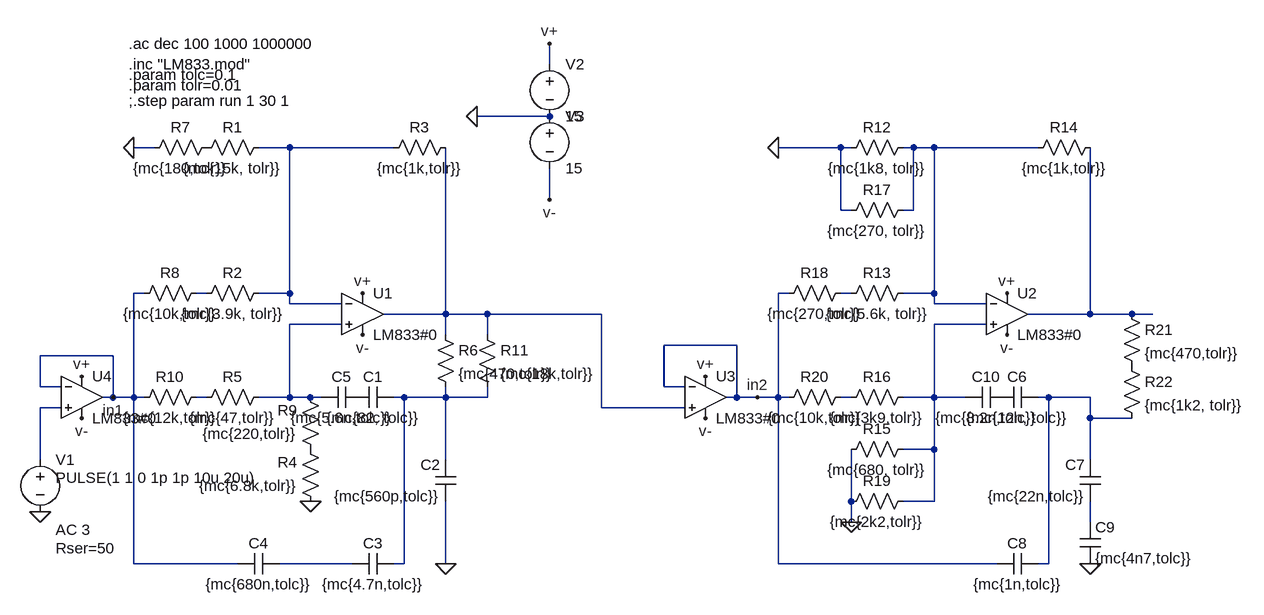
[diagram p0: schematic sedra version 2.asc]
sedra version 2.asc, the LTspice schematic file:
Version 4
SHEET 1 1792 788
WIRE 608 -48 608 -80
WIRE 608 32 496 32
WIRE 0 80 -32 80
WIRE 208 80 160 80
WIRE 368 80 208 80
WIRE 1056 80 960 80
WIRE 1072 80 1056 80
WIRE 1168 80 1152 80
WIRE 1200 80 1168 80
WIRE 1360 80 1200 80
WIRE 608 160 608 112
WIRE 1056 176 1056 80
WIRE 1072 176 1056 176
WIRE 1168 176 1168 80
WIRE 1168 176 1152 176
WIRE -16 304 -32 304
WIRE 80 304 64 304
WIRE 208 304 208 80
WIRE 208 304 160 304
WIRE 976 304 960 304
WIRE 1072 304 1056 304
WIRE 1200 304 1200 80
WIRE 1200 304 1152 304
WIRE 208 320 208 304
WIRE 288 320 208 320
WIRE 1200 320 1200 304
WIRE 1280 320 1200 320
WIRE 448 336 448 80
WIRE 448 336 352 336
WIRE 512 336 448 336
WIRE 688 336 512 336
WIRE 1440 336 1440 80
WIRE 1440 336 1344 336
WIRE 1504 336 1440 336
WIRE 1536 336 1504 336
WIRE 288 352 208 352
WIRE 1280 352 1200 352
WIRE 448 368 448 336
WIRE 512 368 512 336
WIRE 896 384 784 384
WIRE -64 400 -176 400
WIRE -176 448 -176 400
WIRE -144 448 -176 448
WIRE 784 448 784 384
WIRE 816 448 784 448
WIRE -64 464 -64 400
WIRE -64 464 -80 464
WIRE -32 464 -32 304
WIRE -32 464 -64 464
WIRE -16 464 -32 464
WIRE 80 464 64 464
WIRE 208 464 208 352
WIRE 208 464 160 464
WIRE 240 464 208 464
WIRE 256 464 240 464
WIRE 320 464 304 464
WIRE 384 464 368 464
WIRE 448 464 448 448
WIRE 448 464 384 464
WIRE 512 464 512 448
WIRE 512 464 448 464
WIRE 896 464 896 384
WIRE 896 464 880 464
WIRE 928 464 896 464
WIRE 960 464 960 304
WIRE 960 464 928 464
WIRE 976 464 960 464
WIRE 1072 464 1056 464
WIRE 1200 464 1200 352
WIRE 1200 464 1152 464
WIRE 1248 464 1200 464
WIRE 1312 464 1296 464
WIRE 1376 464 1360 464
WIRE 1440 464 1376 464
WIRE -144 480 -176 480
WIRE 688 480 688 336
WIRE 816 480 688 480
WIRE 1440 496 1440 464
WIRE 1504 496 1440 496
WIRE 1200 544 1200 464
WIRE 1200 544 1152 544
WIRE -176 560 -176 480
WIRE 448 560 448 464
WIRE 1440 560 1440 496
WIRE 1072 624 1072 544
WIRE 1200 624 1200 544
WIRE 1200 624 1152 624
WIRE 1072 656 1072 624
WIRE 1440 656 1440 624
WIRE -32 720 -32 464
WIRE 128 720 -32 720
WIRE 304 720 192 720
WIRE 384 720 384 464
WIRE 384 720 368 720
WIRE 448 720 448 624
WIRE 960 720 960 464
WIRE 1296 720 960 720
WIRE 1376 720 1376 464
WIRE 1376 720 1360 720
FLAG -32 80 0
FLAG 240 624 0
FLAG 448 720 0
FLAG -64 464 in1
FLAG 608 -80 v+
FLAG 320 304 v+
FLAG 320 368 v-
FLAG 608 160 v-
FLAG 496 32 0
FLAG 960 80 0
FLAG 1440 720 0
FLAG 1312 304 v+
FLAG 1312 368 v-
FLAG 1072 656 0
FLAG 928 464 in2
FLAG -112 432 v+
FLAG 848 432 v+
FLAG -112 496 v-
FLAG 848 496 v-
FLAG -176 640 0
SYMBOL res 176 64 R90
WINDOW 0 0 56 VBottom 2
WINDOW 3 32 56 VTop 2
SYMATTR InstName R1
SYMATTR Value {mc{15k, tolr}}
SYMBOL res 176 288 R90
WINDOW 0 0 56 VBottom 2
WINDOW 3 32 56 VTop 2
SYMATTR InstName R2
SYMATTR Value {mc{3.9k, tolr}}
SYMBOL res 464 64 R90
WINDOW 0 0 56 VBottom 2
WINDOW 3 32 56 VTop 2
SYMATTR InstName R3
SYMATTR Value {mc{1k,tolr}}
SYMBOL res 256 640 R180
WINDOW 0 36 76 Left 2
WINDOW 3 36 40 Left 2
SYMATTR InstName R4
SYMATTR Value {mc{6.8k,tolr}}
SYMBOL res 64 480 R270
WINDOW 0 32 56 VTop 2
WINDOW 3 0 56 VBottom 2
SYMATTR InstName R5
SYMATTR Value {mc{47,tolr}}
SYMBOL cap 368 448 R90
WINDOW 0 0 32 VBottom 2
WINDOW 3 32 32 VTop 2
SYMATTR InstName C1
SYMATTR Value {mc{82, tolc}}
SYMBOL cap 464 624 R180
WINDOW 0 24 56 Left 2
WINDOW 3 24 8 Left 2
SYMATTR InstName C2
SYMATTR Value {mc{560p,tolc}}
SYMBOL cap 304 736 R270
WINDOW 0 32 32 VTop 2
WINDOW 3 0 32 VBottom 2
SYMATTR InstName C3
SYMATTR Value {mc{4.7n,tolc}}
SYMBOL Opamps\\opamp2 320 272 R0
SYMATTR InstName U1
SYMATTR Value LM833#0
SYMBOL res 96 64 R90
WINDOW 0 0 56 VBottom 2
WINDOW 3 32 56 VTop 2
SYMATTR InstName R7
SYMATTR Value {mc{180,tolr}}
SYMBOL res 80 288 R90
WINDOW 0 0 56 VBottom 2
WINDOW 3 32 56 VTop 2
SYMATTR InstName R8
SYMATTR Value {mc{10k,tolr}}
SYMBOL res 256 560 R180
WINDOW 0 36 76 Left 2
WINDOW 3 36 40 Left 2
SYMATTR InstName R9
SYMATTR Value {mc{220,tolr}}
SYMBOL res -32 480 R270
WINDOW 0 32 56 VTop 2
WINDOW 3 0 56 VBottom 2
SYMATTR InstName R10
SYMATTR Value {mc{12k,tolr}}
SYMBOL res 496 352 R0
SYMATTR InstName R11
SYMATTR Value {mc{18k,tolr}}
SYMBOL res 432 352 R0
SYMATTR InstName R6
SYMATTR Value {mc{470,tolr}}
SYMBOL cap 192 704 R90
WINDOW 0 0 32 VBottom 2
WINDOW 3 32 32 VTop 2
SYMATTR InstName C4
SYMATTR Value {mc{680n,tolc}}
SYMBOL cap 320 448 R90
WINDOW 0 0 32 VBottom 2
WINDOW 3 32 32 VTop 2
SYMATTR InstName C5
SYMATTR Value {mc{5.6n,tolc}}
SYMBOL voltage 608 -64 R0
WINDOW 123 0 0 Left 2
WINDOW 39 0 0 Left 2
SYMATTR InstName V2
SYMATTR Value 15
SYMBOL voltage 608 16 R0
SYMATTR InstName V3
SYMATTR Value 15
SYMBOL res 1168 64 R90
WINDOW 0 0 56 VBottom 2
WINDOW 3 32 56 VTop 2
SYMATTR InstName R12
SYMATTR Value {mc{1k8, tolr}}
SYMBOL res 1168 288 R90
WINDOW 0 0 56 VBottom 2
WINDOW 3 32 56 VTop 2
SYMATTR InstName R13
SYMATTR Value {mc{5.6k, tolr}}
SYMBOL res 1456 64 R90
WINDOW 0 0 56 VBottom 2
WINDOW 3 32 56 VTop 2
SYMATTR InstName R14
SYMATTR Value {mc{1k,tolr}}
SYMBOL res 1056 480 R270
WINDOW 0 32 56 VTop 2
WINDOW 3 0 56 VBottom 2
SYMATTR InstName R16
SYMATTR Value {mc{3k9,tolr}}
SYMBOL cap 1360 448 R90
WINDOW 0 0 32 VBottom 2
WINDOW 3 32 32 VTop 2
SYMATTR InstName C6
SYMATTR Value {mc{12n, tolc}}
SYMBOL cap 1456 624 R180
WINDOW 0 24 56 Left 2
WINDOW 3 24 8 Left 2
SYMATTR InstName C7
SYMATTR Value {mc{22n,tolc}}
SYMBOL cap 1296 736 R270
WINDOW 0 32 32 VTop 2
WINDOW 3 0 32 VBottom 2
SYMATTR InstName C8
SYMATTR Value {mc{1n,tolc}}
SYMBOL Opamps\\opamp2 1312 272 R0
SYMATTR InstName U2
SYMATTR Value LM833#0
SYMBOL res 1072 288 R90
WINDOW 0 0 56 VBottom 2
WINDOW 3 32 56 VTop 2
SYMATTR InstName R18
SYMATTR Value {mc{270,tolr}}
SYMBOL res 960 480 R270
WINDOW 0 32 56 VTop 2
WINDOW 3 0 56 VBottom 2
SYMATTR InstName R20
SYMATTR Value {mc{10k,tolr}}
SYMBOL cap 1312 448 R90
WINDOW 0 0 32 VBottom 2
WINDOW 3 32 32 VTop 2
SYMATTR InstName C10
SYMATTR Value {mc{8.2n,tolc}}
SYMBOL res 1168 160 R90
WINDOW 0 0 56 VBottom 2
WINDOW 3 32 56 VTop 2
SYMATTR InstName R17
SYMATTR Value {mc{270, tolr}}
SYMBOL res 1168 528 R90
WINDOW 0 0 56 VBottom 2
WINDOW 3 32 56 VTop 2
SYMATTR InstName R15
SYMATTR Value {mc{680, tolr}}
SYMBOL res 1168 608 R90
WINDOW 0 0 56 VBottom 2
WINDOW 3 32 56 VTop 2
SYMATTR InstName R19
SYMATTR Value {mc{2k2,tolr}}
SYMBOL res 1488 320 R0
SYMATTR InstName R21
SYMATTR Value {mc{470,tolr}}
SYMBOL res 1488 400 R0
SYMATTR InstName R22
SYMATTR Value {mc{1k2, tolr}}
SYMBOL cap 1424 656 R0
SYMATTR InstName C9
SYMATTR Value {mc{4n7,tolc}}
SYMBOL Opamps\\opamp2 -112 400 R0
SYMATTR InstName U4
SYMATTR Value LM833#0
SYMBOL voltage -176 544 R0
WINDOW 123 24 124 Left 2
WINDOW 39 24 152 Left 2
WINDOW 3 24 44 Left 2
SYMATTR Value2 AC 3
SYMATTR SpiceLine Rser=50
SYMATTR InstName V1
SYMATTR Value PULSE(1 1 0 1p 1p 10u 20u)
SYMBOL Opamps\\opamp2 848 400 R0
SYMATTR InstName U3
SYMATTR Value LM833#0
TEXT -40 -48 Left 2 !.inc "LM833.mod"
TEXT -40 -32 Left 2 !.param tolc=0.1
TEXT -40 -16 Left 2 !.param tolr=0.01
TEXT -40 -80 Left 2 !.ac dec 100 1000 1000000
TEXT -40 8 Left 2 !;.step param run 1 30 1

The netlist it stands for:
* sedra version 2.asc
R1 N001 P001 {mc{15k, tolr}}
R2 N001 N003 {mc{3.9k, tolr}}
R3 N005 N001 {mc{1k,tolr}}
R4 0 P002 {mc{6.8k,tolr}}
R5 N009 N007 {mc{47,tolr}}
C1 N011 N010 {mc{82, tolc}}
C2 0 N011 {mc{560p,tolc}}
C3 N017 N011 {mc{4.7n,tolc}}
XU1 N007 N001 v+ v- N005 LM833#0  ; pins In+ In- V+ V- OUT
R7 P001 0 {mc{180,tolr}}
R8 N003 in1 {mc{10k,tolr}}
R9 P002 N007 {mc{220,tolr}}
R10 in1 N009 {mc{12k,tolr}}
R11 N005 N011 {mc{18k,tolr}}
R6 N005 N011 {mc{470,tolr}}
C4 N017 in1 {mc{680n,tolc}}
C5 N010 N007 {mc{5.6n,tolc}}
V2 v+ 0 15
V3 0 v- 15
R12 N002 0 {mc{1k8, tolr}}
R13 N002 N004 {mc{5.6k, tolr}}
R14 N006 N002 {mc{1k,tolr}}
R16 N012 N008 {mc{3k9,tolr}}
C6 N014 N013 {mc{12n, tolc}}
C7 N016 N014 {mc{22n,tolc}}
C8 in2 N014 {mc{1n,tolc}}
XU2 N008 N002 v+ v- N006 LM833#0  ; pins In+ In- V+ V- OUT
R18 N004 in2 {mc{270,tolr}}
R20 in2 N012 {mc{10k,tolr}}
C10 N013 N008 {mc{8.2n,tolc}}
R17 N002 0 {mc{270, tolr}}
R15 N008 0 {mc{680, tolr}}
R19 N008 0 {mc{2k2,tolr}}
R21 N006 P003 {mc{470,tolr}}
R22 P003 N014 {mc{1k2, tolr}}
C9 N016 0 {mc{4n7,tolc}}
XU4 N015 in1 v+ v- in1 LM833#0  ; pins In+ In- V+ V- OUT
V1 N015 0 PULSE(1 1 0 1p 1p 10u 20u) AC 3 Rser=50
XU3 N005 in2 v+ v- in2 LM833#0  ; pins In+ In- V+ V- OUT
.inc "LM833.mod"
.param tolc=0.1
.param tolr=0.01
.ac dec 100 1000 1000000
;.step param run 1 30 1
.backanno
.end